# EAGLE design charger_and_dc_dc_ctrl (EAGLE 6.6.0)

## Sheet 1 of 3: Processor and Supply
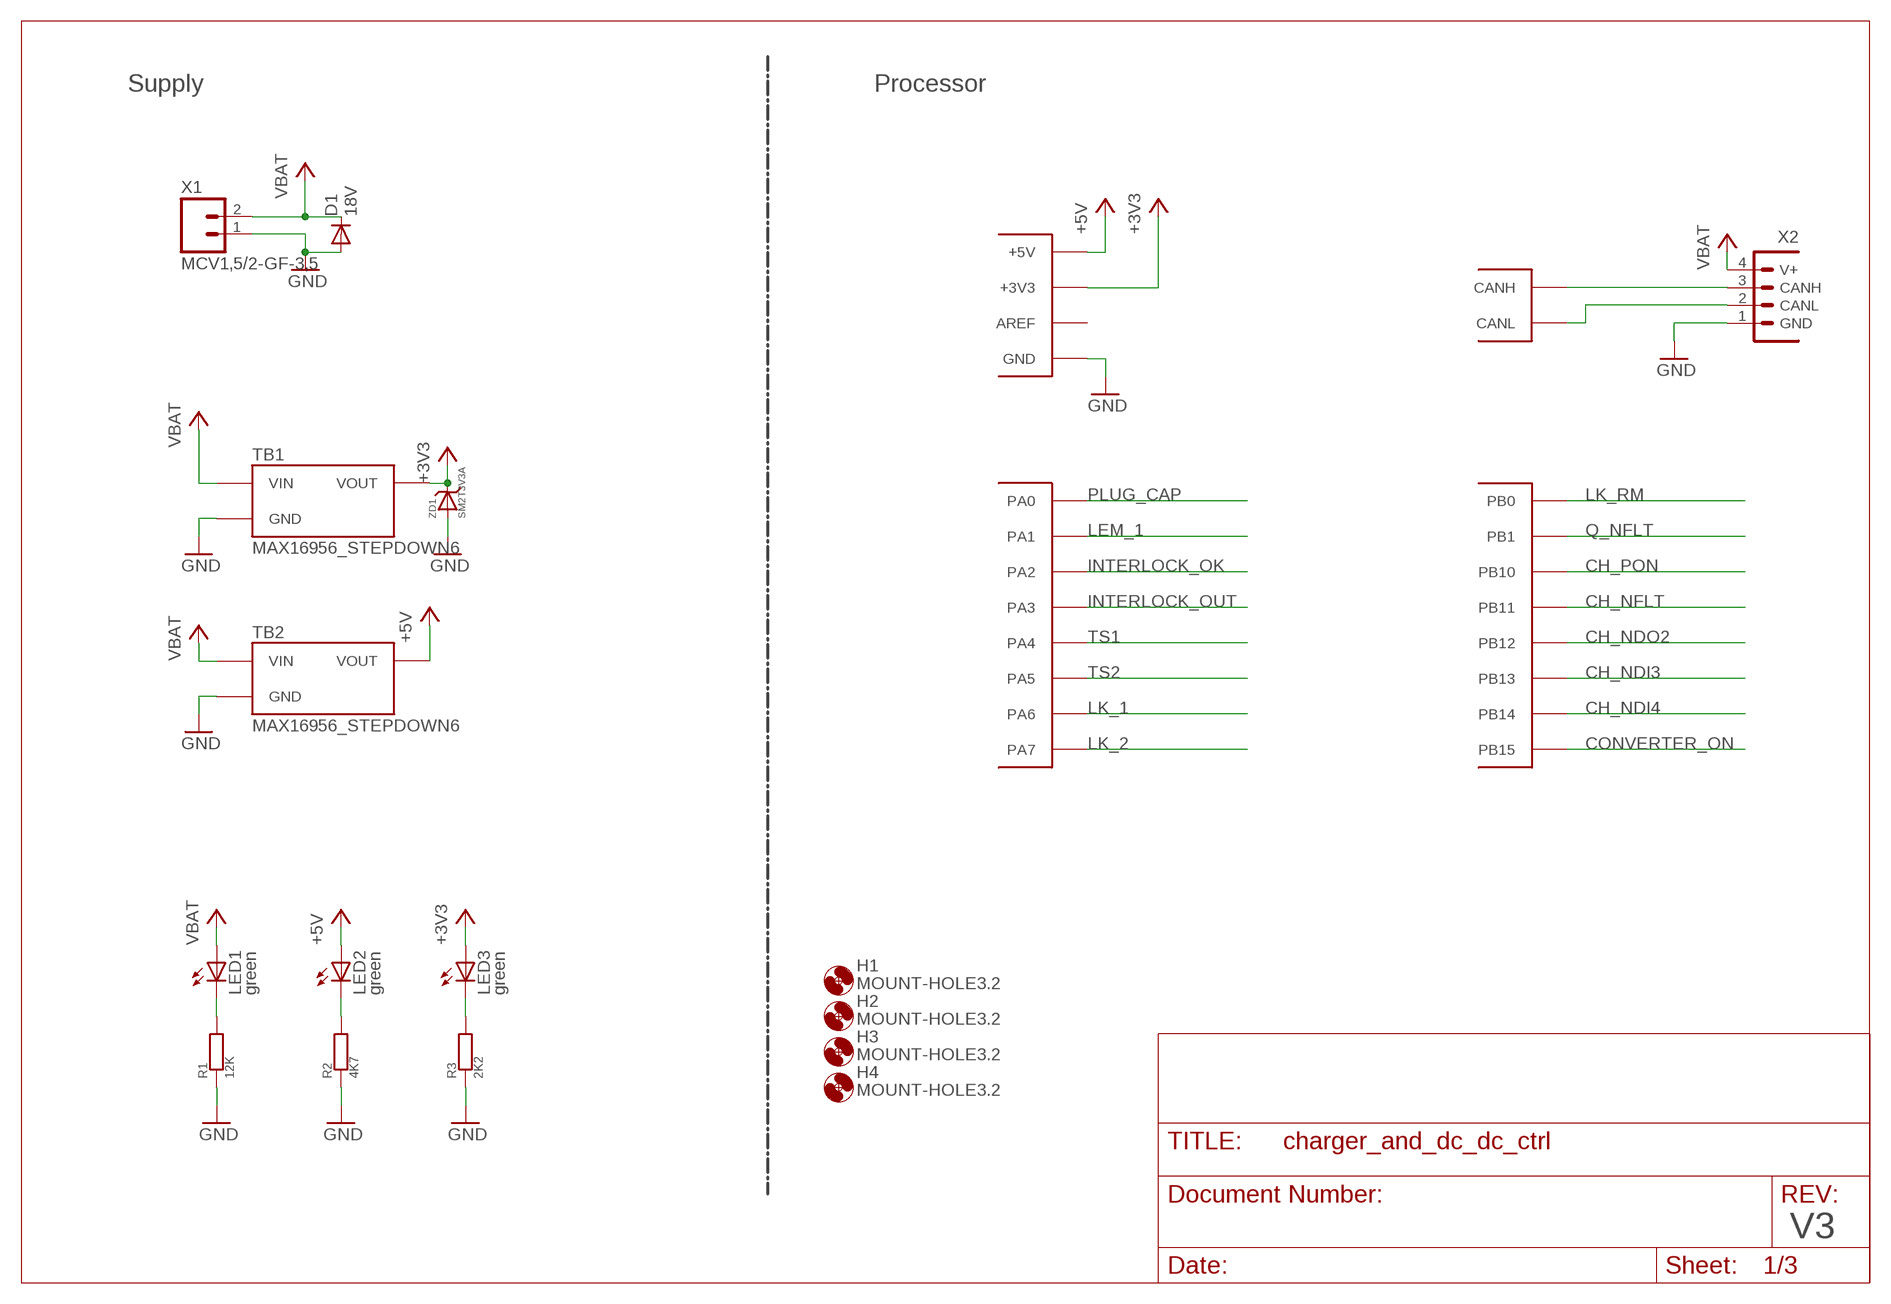
[diagram p0: schematic, sheet 1]

### Parts
CANIO_1  STM32F103XX_CAN-IO-EXPANDERC  [STM32F103XX_CANIO-EXPANDER3]
D1  18V  DIODE-DO214AA  [DO214AA]
H1  MOUNT-HOLE3.2  [3,2]
H2  MOUNT-HOLE3.2  [3,2]
H3  MOUNT-HOLE3.2  [3,2]
H4  MOUNT-HOLE3.2  [3,2]
LED1  green  LEDCHIP-LED0805  [CHIP-LED0805]
LED2  green  LEDCHIP-LED0805  [CHIP-LED0805]
LED3  green  LEDCHIP-LED0805  [CHIP-LED0805]
R1  12K  R  [R0805]
R2  4K7  R  [R0805]
R3  2K2  R  [R0805]
TB1  MAX16956_STEPDOWN6  [MAX16956_STEPDOWN6]
TB2  MAX16956_STEPDOWN6  [MAX16956_STEPDOWN6]
X1  MCV1,5/2-GF-3,5  [MCV1,5/2-GF-3,5]
X2  CIOC_4-1-FV-A_CAN-BELEGUNG  [CIOC_4-1-FV]
ZD1  SM2T3V3A  [SM2T3V3A]

### Nets
+3V3: CANIO_1.VCC(+3V3) LED3.A TB1.VOUT ZD1.P$2 ; also sheet 2,3
+5V: CANIO_1.+5V LED2.A TB2.VOUT ; also sheet 2
CAN1_H: CANIO_1.CANH X2.3(CANH)
CAN1_L: CANIO_1.CANL X2.2(CANL)
CH_NDI3: CANIO_1.PB13 ; also sheet 3
CH_NDI4: CANIO_1.PB14 ; also sheet 3
CH_NDO2: CANIO_1.PB12 ; also sheet 3
CH_NFLT: CANIO_1.PB11 ; also sheet 3
CH_PON: CANIO_1.PB10 ; also sheet 3
CONVERTER_ON: CANIO_1.PB15 ; also sheet 3
GND: CANIO_1.GND1(GND) D1.A R1.1 R2.1 R3.1 TB1.GND TB1.GND2(GND) TB2.GND TB2.GND2(GND) X1.1 X2.1(GND) ZD1.P$1 ZD1.P$11 ; also sheet 2,3
INTERLOCK_OK: CANIO_1.PA2 ; also sheet 2
INTERLOCK_OUT: CANIO_1.PA3 ; also sheet 2
LEM_1: CANIO_1.PA1 ; also sheet 2
LK_1: CANIO_1.PA6 ; also sheet 3
LK_2: CANIO_1.PA7 ; also sheet 3
LK_RM: CANIO_1.PB0 ; also sheet 3
N$1: LED2.C R2.2
N$2: LED3.C R3.2
N$5: LED1.C R1.2
PLUG_CAP: CANIO_1.PA0 ; also sheet 3
Q_NFLT: CANIO_1.PB1 ; also sheet 3
TS1: CANIO_1.PA4 ; also sheet 2
TS2: CANIO_1.PA5 ; also sheet 2
VBAT: D1.C LED1.A TB1.VIN TB2.VIN X1.2 X2.4(V+) ; also sheet 2,3
Unconnected: CANIO_1.AREF

### Notes on the sheet
- Supply | Processor
- V3

## Sheet 2 of 3: IO
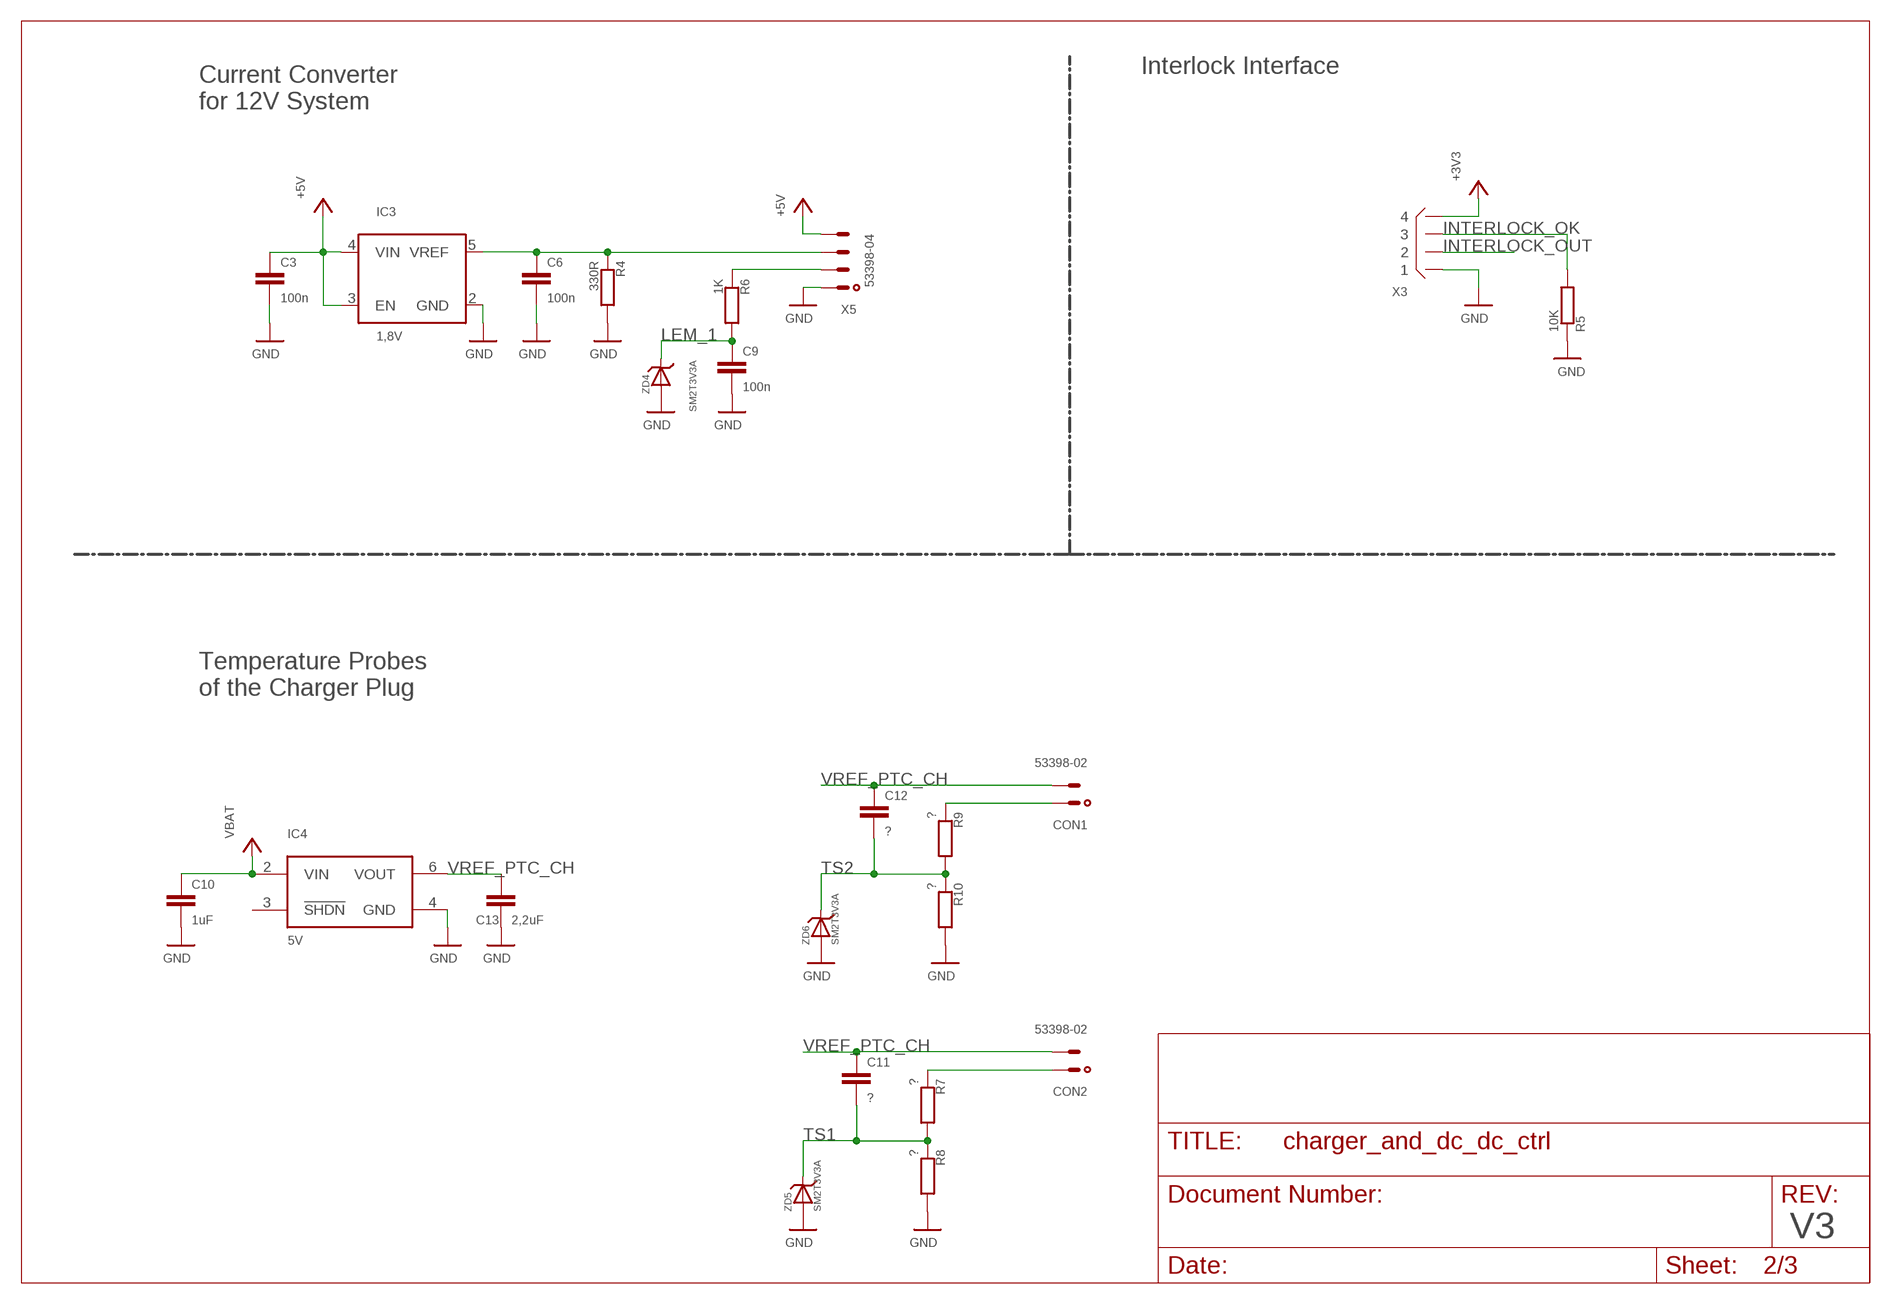
[diagram p1: schematic, sheet 2]

### Parts
C3  100n  C-EUC0805  [C0805]
C6  100n  C-EUC0805  [C0805]
C9  100n  C-EUC0805  [C0805]
C10  1uF  C-EUC0805  [C0805]
C11  ?  C-EUC0805  [C0805]
C12  ?  C-EUC0805  [C0805]
C13  2,2uF  C-EUC0805  [C0805]
CON1  53398-02  [53398-02]
CON2  53398-02  [53398-02]
IC3  1,8V  LM4132L  [SOT23-5L]
IC4  5V  LT1461  [SO08]
R4  330R  R  [R0805]
R5  10K  R0603  [R0603]
R6  1K  R  [R0805]
R7  ?  R  [R0805]
R8  ?  R  [R0805]
R9  ?  R  [R0805]
R10  ?  R  [R0805]
X3  B4B-XH  [B4B-XH]
X5  53398-04  [53398-04]
ZD4  SM2T3V3A  [SM2T3V3A]
ZD5  SM2T3V3A  [SM2T3V3A]
ZD6  SM2T3V3A  [SM2T3V3A]

### Nets
+3V3: X3.P$4 ; also sheet 1,3
+5V: C3.1 IC3.3(EN) IC3.4(VIN) X5.4 ; also sheet 1
GND: C3.2 C6.2 C9.2 C10.2 C13.2 IC3.2(GND) IC4.4(GND) R4.2 R5.1 R8.2 R10.2 X3.P$1 X5.1 ZD4.P$1 ZD4.P$11 ZD5.P$1 ZD5.P$11 ZD6.P$1 ZD6.P$11 ; also sheet 1,3
INTERLOCK_OK: R5.2 X3.P$3 ; also sheet 1
INTERLOCK_OUT: X3.P$2 ; also sheet 1
LEM_1: C9.1 R6.2 ZD4.P$2 ; also sheet 1
N$7: R6.1 X5.2
N$25: CON1.1 R9.1
N$32: C6.1 IC3.5(VREF) R4.1 X5.3
N$35: CON2.1 R7.1
TS1: C11.2 R7.2 R8.1 ZD5.P$2 ; also sheet 1
TS2: C12.2 R9.2 R10.1 ZD6.P$2 ; also sheet 1
VBAT: C10.1 IC4.2(VIN) ; also sheet 1,3
VREF_PTC_CH: C11.1 C12.1 C13.1 CON1.2 CON2.2 IC4.6(VOUT)
Unconnected: IC4.3(!SHDN)

### Notes on the sheet
- Interlock Interface
- Current Converter
  for 12V System
- Temperature Probes
  of the Charger Plug
- V3

## Sheet 3 of 3: Laderegler und Ladestecker
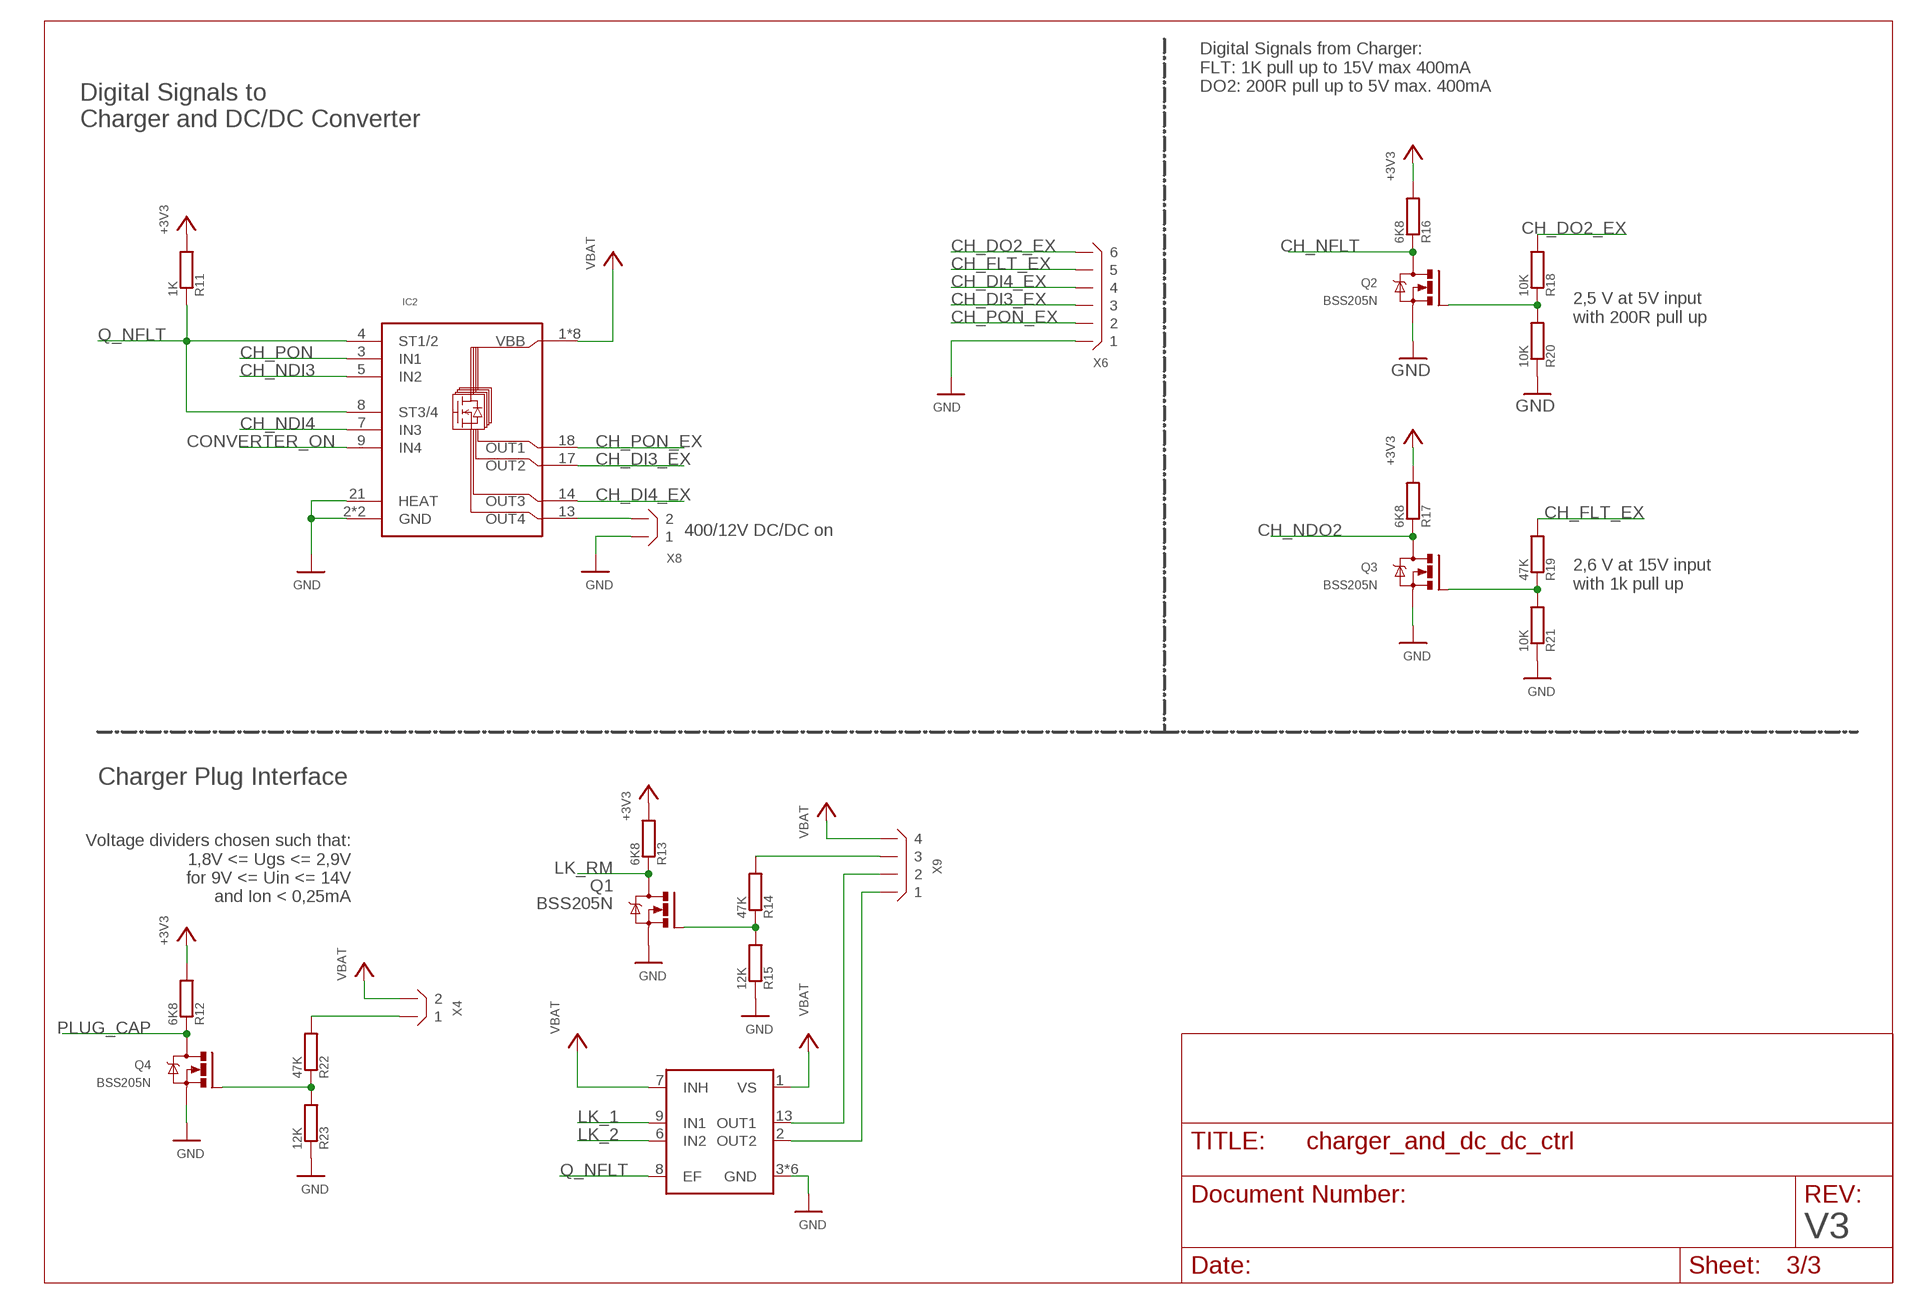
[diagram p2: schematic, sheet 3]

### Parts
IC2  BTS716G-NEWM  [INF-PG-DSO-20-30_M_1PRIMARY]
IC6  TLE4207GN  [INF-PG-DSO-14-22_N_1PRIMARY]
Q1  BSS205N  [SOT23]
Q2  BSS205N  [SOT23]
Q3  BSS205N  [SOT23]
Q4  BSS205N  [SOT23]
R11  1K  R0603  [R0603]
R12  6K8  R0603  [R0603]
R13  6K8  R  [R0805]
R14  47K  R  [R0805]
R15  12K  R  [R0805]
R16  6K8  R0603  [R0603]
R17  6K8  R0603  [R0603]
R18  10K  R0603  [R0603]
R19  47K  R0603  [R0603]
R20  10K  R0603  [R0603]
R21  10K  R0603  [R0603]
R22  47K  R0603  [R0603]
R23  12K  R0603  [R0603]
X4  B2B-XH  [B2B-XH]
X6  B6B-XH  [B6B-XH]
X8  B2B-XH  [B2B-XH]
X9  B4B-XH  [B4B-XH]

### Nets
+3V3: R11.2 R12.2 R13.2 R16.2 R17.2 ; also sheet 1,2
CH_DI3_EX: IC2.17(OUT2) X6.P$3
CH_DI4_EX: IC2.14(OUT3) X6.P$4
CH_DO2_EX: R18.2 X6.P$6
CH_FLT_EX: R19.2 X6.P$5
CH_NDI3: IC2.5(IN2) ; also sheet 1
CH_NDI4: IC2.7(IN3) ; also sheet 1
CH_NDO2: Q3.3(D) R17.1 ; also sheet 1
CH_NFLT: Q2.3(D) R16.1 ; also sheet 1
CH_PON: IC2.3(IN1) ; also sheet 1
CH_PON_EX: IC2.18(OUT1) X6.P$2
CONVERTER_ON: IC2.9(IN4) ; also sheet 1
GND: IC2.2(GND) IC2.6(GND) IC2.21(HEAT) IC6.3(GND) IC6.4(GND) IC6.5(GND) IC6.10(GND) IC6.11(GND) IC6.12(GND) Q1.2(S) Q2.2(S) Q3.2(S) Q4.2(S) R15.1 R20.1 R21.1 R23.1 X6.P$1 X8.P$1 ; also sheet 1,2
LK_1: IC6.9(IN1) ; also sheet 1
LK_2: IC6.6(IN2) ; also sheet 1
LK_RM: Q1.3(D) R13.1 ; also sheet 1
N$3: IC2.13(OUT4) X8.P$2
N$4: Q4.1(G) R22.1 R23.2
N$6: R22.2 X4.P$1
N$16: Q3.1(G) R19.1 R21.2
N$38: Q1.1(G) R14.1 R15.2
N$39: R14.2 X9.P$3
N$41: IC6.13(OUT1) X9.P$2
N$42: IC6.2(OUT2) X9.P$1
N$45: Q2.1(G) R18.1 R20.2
PLUG_CAP: Q4.3(D) R12.1 ; also sheet 1
Q_NFLT: IC2.4(ST1/2) IC2.8(ST3/4) IC6.8(EF) R11.1 ; also sheet 1
VBAT: IC2.1(VBB) IC2.10(VBB) IC2.11(VBB) IC2.12(VBB) IC2.15(VBB) IC2.16(VBB) IC2.19(VBB) IC2.20(VBB) IC6.1(VS) IC6.7(INH) X4.P$2 X9.P$4 ; also sheet 1,2

### Notes on the sheet
- Digital Signals from Charger:
  FLT: 1K pull up to 15V max 400mA
  DO2: 200R pull up to 5V max. 400mA
- Digital Signals to
  Charger and DC/DC Converter
- 2,5 V at 5V input 
  with 200R pull up
- 400/12V DC/DC on
- 2,6 V at 15V input
  with 1k pull up
- Charger Plug Interface
- Voltage dividers chosen such that:
  1,8V <= Ugs <= 2,9V
  for 9V <= Uin <= 14V
  and Ion < 0,25mA
- V3

## Library data of the parts
C3 C6 C9-C13 = rcl:C-EU: CAPACITOR, European symbol
CANIO_1 = tera-boards:STM32F103XX_CAN-IO-EXPANDER: Tera CAN-IO Expander Board
CON1 CON2 = con-molex:53?-02: CONNECTOR wire to board 1.25 mm (.049 inch) pitch header
D1 = diode:DIODE-: DIODE
H1-H4 = holes:MOUNT-HOLE: MOUNTING HOLE with drill center marker
IC2 = infineon:BTS716G-NEW
IC3 = ti:LM4132
IC4 = linear:LT1461
IC6 = infineon:TLE4207G
LED1-LED3 = led:LED: LED OSRAM: - CHIPLED LG R971, LG N971, LY N971, LG Q971, LY Q971, LO R971, LY R971 LH N974, LH R974 LS Q976, LO Q976, LY Q976 LO Q996 - Hyper CHIPLED LW Q18S LB Q993, LB Q99A, LB R99A - SideLED LS A670, LO A670, LY A670, LG A670, LP A670 LB A673, LV A673, LT A673, LW A673 LH A674 LY A675 LS A676, LA A676, LO A676, LY A676, LW A676 LS A679, LY A679, LG A679 - Hyper Micro SIDELED® LS Y876, LA Y876, LO Y876, LY Y876 LT Y87S - SmartLED LW L88C, LW L88S LB L89C, LB L89S, LG L890 LS L89K, LO L89K, LY L89K LS L896, LA L896, LO L896, LY L896 - TOPLED LS T670, LO T670, LY T670, LG T670, LP T670 LSG T670, LSP T670, LSY T670, LOP T670, LYG T670 LG T671, LOG T671, LSG T671 LB T673, LV T673, LT T673, LW T673 LH T674 LS T676, LA T676, LO T676, LY T676, LB T676, LH T676, LSB T676, LW T676 LB T67C, LV T67C, LT T67C, LS T67K, LO T67K, LY T67K, LW E67C LS E67B, LA E67B, LO E67B, LY E67B, LB E67C, LV E67C, LT E67C LW T67C LS T679, LY T679, LG T679 LS T770, LO T770, LY T770, LG T770, LP T770 LB T773, LV T773, LT T773, LW T773 LH T774 LS E675, LA E675, LY E675, LS T675 LS T776, LA T776, LO T776, LY T776, LB T776 LHGB T686 LT T68C, LB T68C - Hyper Mini TOPLED® LB M676 - Mini TOPLED Santana® LG M470 LS M47K, LO M47K, LY M47K Source: http://www.osram.convergy.de LUXEON: - LUMILED® LXK2-PW12-R00, LXK2-PW12-S00, LXK2-PW14-U00, LXK2-PW14-V00 LXK2-PM12-R00, LXK2-PM12-S00, LXK2-PM14-U00 LXK2-PE12-Q00, LXK2-PE12-R00, LXK2-PE12-S00, LXK2-PE14-T00, LXK2-PE14-U00 LXK2-PB12-K00, LXK2-PB12-L00, LXK2-PB12-M00, LXK2-PB14-N00, LXK2-PB14-P00, LXK2-PB14-Q00 LXK2-PR12-L00, LXK2-PR12-M00, LXK2-PR14-Q00, LXK2-PR14-R00 LXK2-PD12-Q00, LXK2-PD12-R00, LXK2-PD12-S00 LXK2-PH12-R00, LXK2-PH12-S00 LXK2-PL12-P00, LXK2-PL12-Q00, LXK2-PL12-R00 Source: www.luxeon.com KINGBRIGHT: KA-3528ASYC Source: www.kingbright.com
Q1-Q4 = infineon:BSS205N: Infineon Small Signal Transistor, OptiMOS 2 Technology, 20V, 2.5A SOT23
R1-R23 = useful:R
TB1 TB2 = tera-boards:MAX16956_STEPDOWN6
X1 = con-phoenix:MCV1,5/2-GF-3,5
X2 = con-phoenix:CIOC_4-1-FV-A_CAN-BELEGUNG: CIOC_4-1-FV-A mit Bezeichnungen für CAN-Signale und Versorgungen; MANUF: Phoenix-Contact; ORDERNR: 1701388
X3 X9 = con-jst-xh:?4B-XH
X4 X8 = con-jst-xh:?2B-XH
X5 = con-molex:53?-04: CONNECTOR wire to board 1.25 mm (.049 inch) pitch header
X6 = con-jst-xh:?6B-XH
ZD1 ZD4-ZD6 = st:SM2T3V3A: ST2T3V3A Low voltage TransilTM

## Board
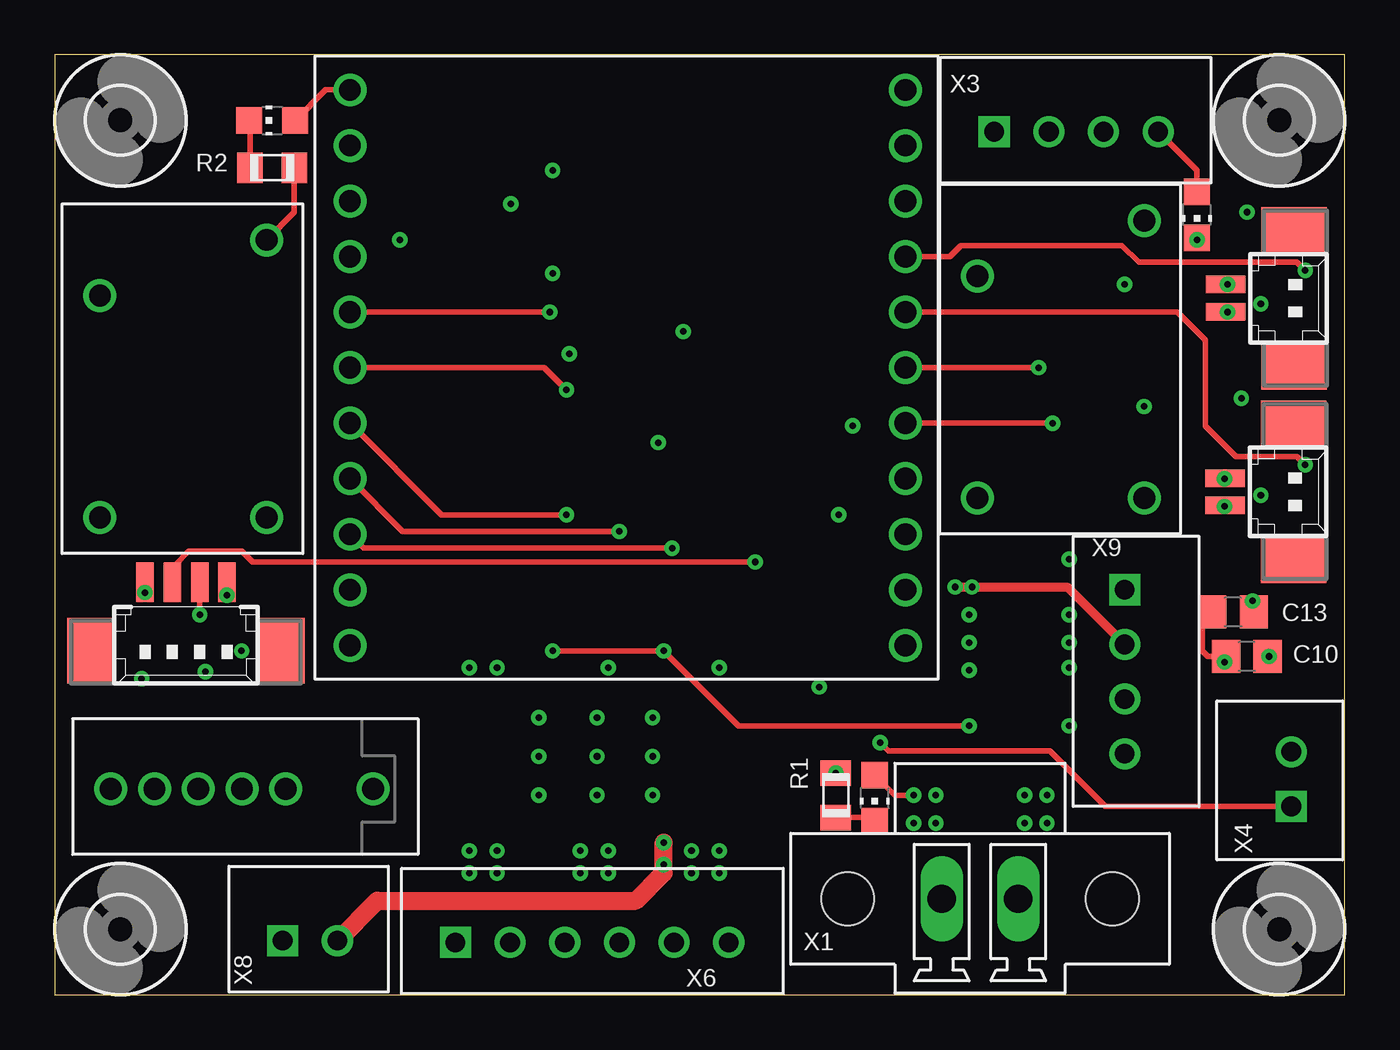
[diagram p3: board, top side]
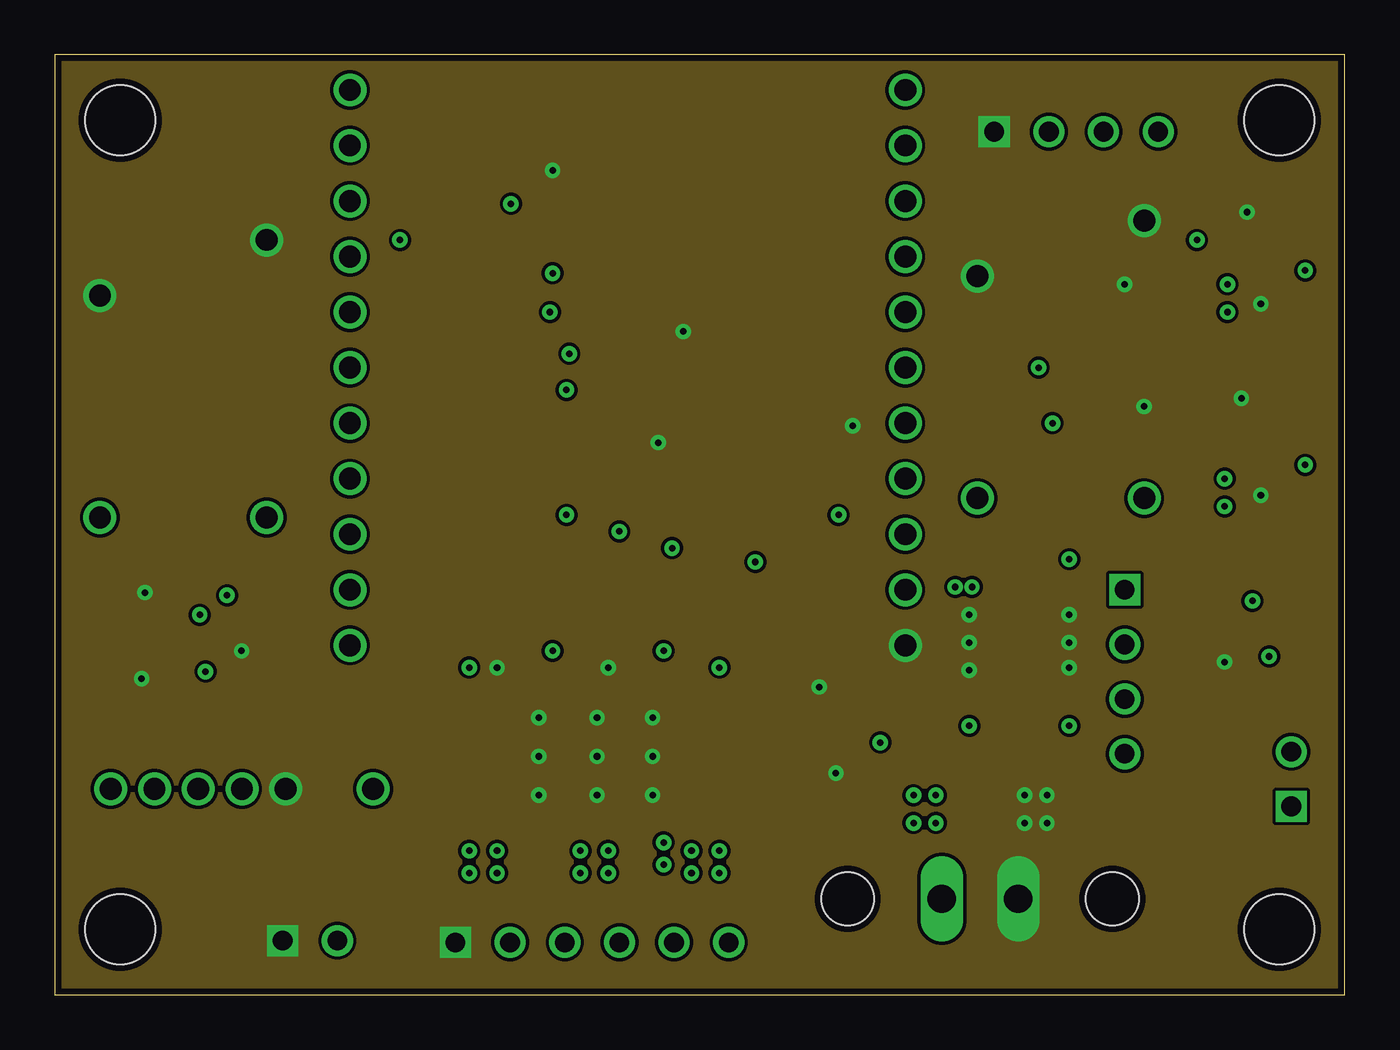
[diagram p4: board, inner layer Route2]
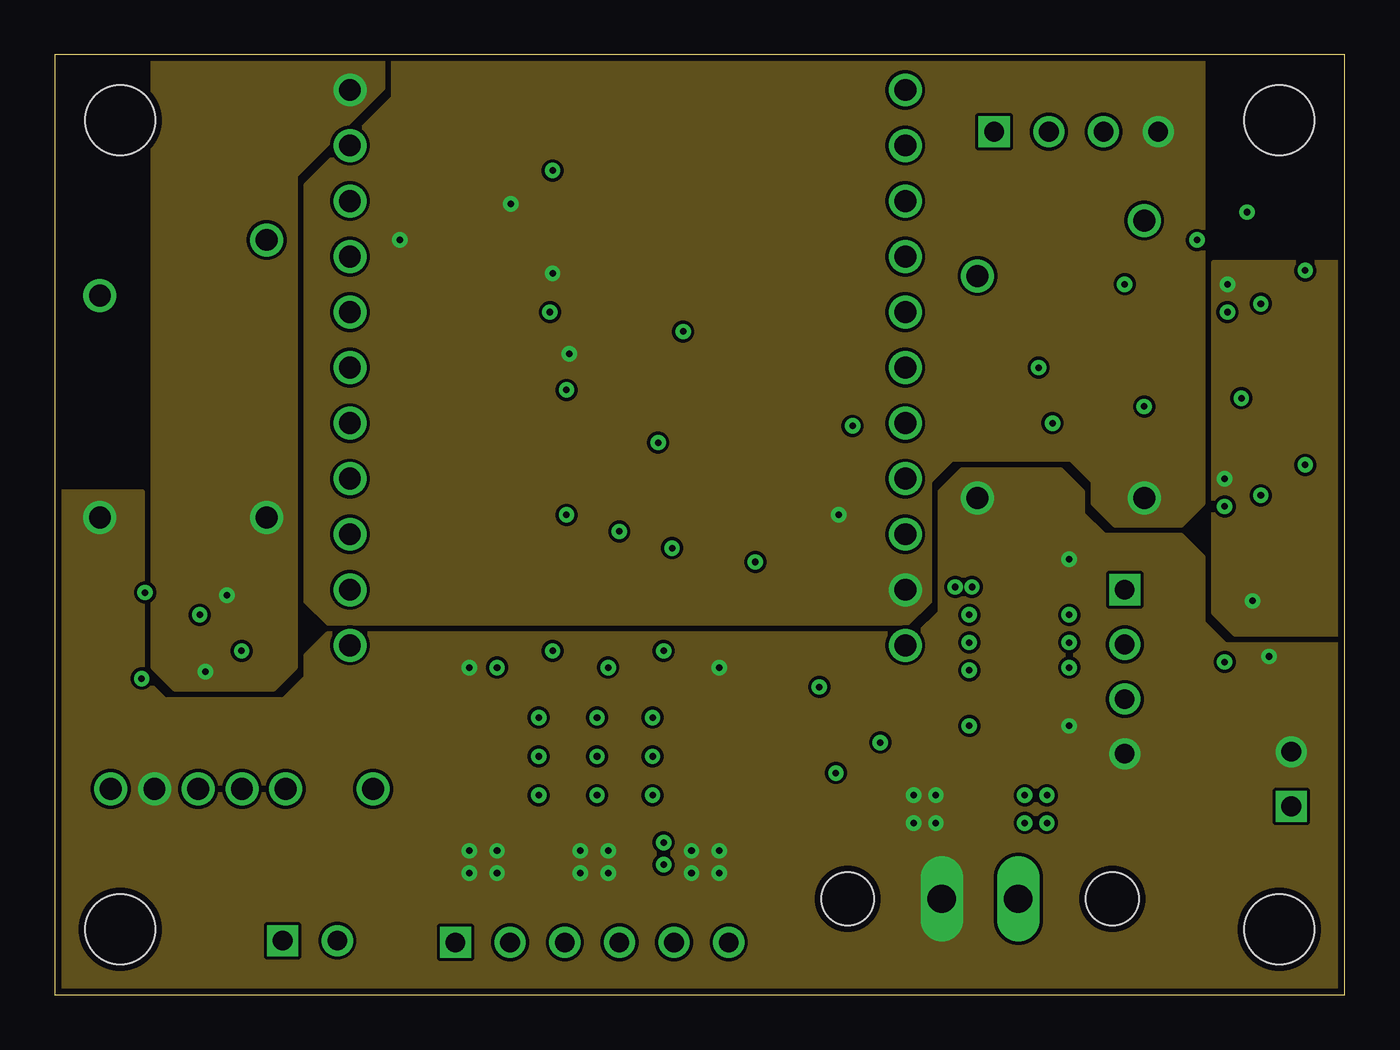
[diagram p5: board, inner layer Route15]
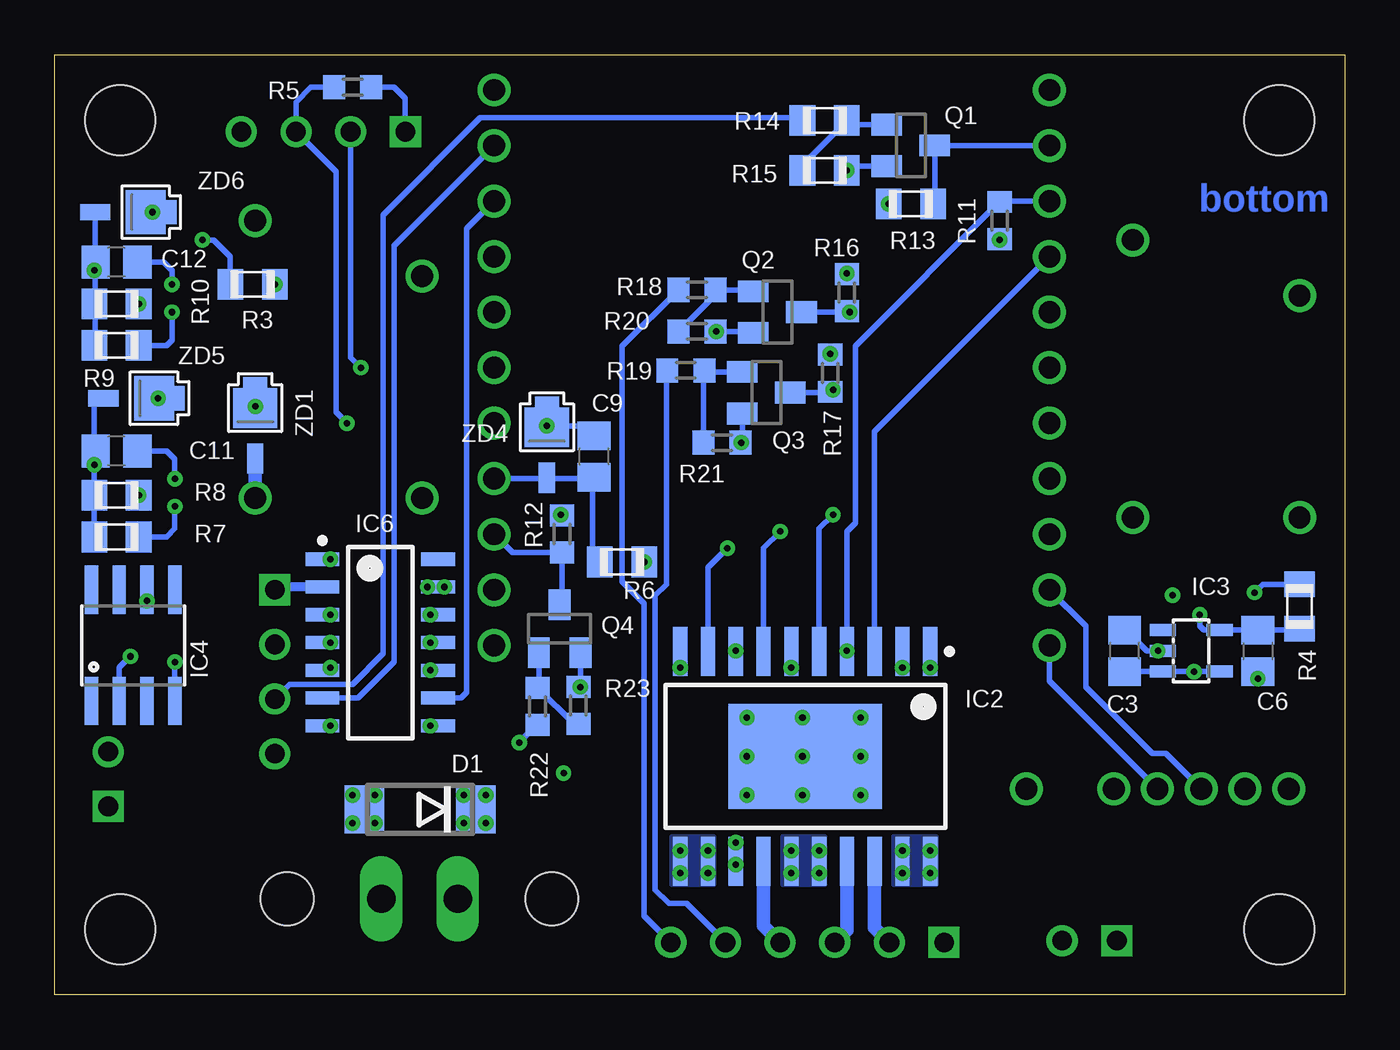
[diagram p6: board, bottom side, seen from below]

Size 59 x 43 mm. Coordinates in mm from the lower left corner, seen from the top.
Outline: 0,0 59,0 59,43 0,43 0,0
Copper layers (1+2*15+16): Top 0.035mm / dielectric 0.2mm / Route2 0.035mm / dielectric 0.5mm / Route15 0.035mm / dielectric 0.2mm / Bottom 0.035mm
Design rules "ats_35u_4layer *": minimum track width 6mil, minimum drill 0.2mm, track to track 6mil, track to pad 6mil, pad to pad 6mil, via to via 6mil, smd to smd 6mil, copper to edge 0.3mm, drill to drill 8mil, minimum pad ring 10mil, minimum via ring 0.2mm, stop-mask expansion 4mil, vias tented up to drill 0mil, thermal gap 10mil

### Footprints (pad centres in the part's own frame; a part is rotated, then mirrored left to right if it is on the bottom)
C0805 = smd 1.3 x 1.5: 1 -0.95,0; 2 0.95,0
STM32F103XX_CANIO-EXPANDER3 = drill 1: +5V -12.7,12.7; AREF 12.7,12.7; CANH -12.7,-10.16; CANL -12.7,-12.7; GND1 12.7,-12.7; PA0 12.7,-7.62; PA1 12.7,-5.08; PA2 12.7,-2.54; PA3 12.7,0; PA4 12.7,2.54; PA5 12.7,5.08; PA6 12.7,7.62; PA7 12.7,10.16; PB0 -12.7,10.16; PB1 -12.7,7.62; PB10 -12.7,5.08; PB11 -12.7,2.54; PB12 -12.7,0; PB13 -12.7,-2.54; PB14 -12.7,-5.08; PB15 -12.7,-7.62; VCC 12.7,-10.16
53398-02 = smd 0.8 x 1.8: 1 0.625,-2.5; 2 -0.625,-2.5 | smd 2.1 x 3: S1 3.125,0.625; S2 -3.125,0.625
DO214AA = smd 1.8 x 2.2: A 2.55,0; C -2.55,0
3,2 = hole 3.2: 0,0
INF-PG-DSO-20-30_M_1PRIMARY = smd 2.25 x 0.65: 1 -4.8,5.715; 2 -4.8,4.445; 3 -4.8,3.175; 4 -4.8,1.905; 5 -4.8,0.635; 6 -4.8,-0.635; 7 -4.8,-1.905; 8 -4.8,-3.175; 9 -4.8,-4.445; 10 -4.8,-5.715; 11 4.8,-5.715; 12 4.8,-4.445; 13 4.8,-3.175; 14 4.8,-1.905; 15 4.8,-0.635; 16 4.8,0.635; 17 4.8,1.905; 18 4.8,3.175; 19 4.8,4.445; 20 4.8,5.715 | smd 4.8 x 7: 21 0,0
SOT23-5L = smd 0.55 x 1.2: 1 -0.95,-1.3; 2 0,-1.3; 3 0.95,-1.3; 4 0.95,1.3; 5 -0.95,1.3
SO08 = smd 0.61 x 2.21: 1 -1.905,-2.54; 2 -0.635,-2.54; 3 0.635,-2.54; 4 1.905,-2.54; 5 1.905,2.54; 6 0.635,2.54; 7 -0.635,2.54; 8 -1.905,2.54
INF-PG-DSO-14-22_N_1PRIMARY = smd 1.55 x 0.6: 1 -2.65,3.81; 2 -2.65,2.54; 3 -2.65,1.27; 4 -2.65,0; 5 -2.65,-1.27; 6 -2.65,-2.54; 7 -2.65,-3.81; 8 2.65,-3.81; 9 2.65,-2.54; 10 2.65,-1.27; 11 2.65,0; 12 2.65,1.27; 13 2.65,2.54; 14 2.65,3.81
CHIP-LED0805 = smd 1.2 x 1.2: A 0,-1.05; C 0,1.05
SOT23 = smd 1 x 1.4: 1 -0.95,-1.1; 2 0.95,-1.1; 3 0,1.1
R0805 = smd 1.168 x 1.397: 1 -1.016,0; 2 1.016,0
R0603 = smd 1 x 1.1: 1 -0.85,0; 2 0.85,0
MAX16956_STEPDOWN6 = drill 1: GND 14.351,1.651; GND2 11.811,9.271; VIN 1.651,9.271; VOUT 1.651,1.651
MCV1,5/2-GF-3,5 = drill 1.3 long: 1 0,3.5; 2 0,0 | hole 2.4: 0,7.8; 0,-4.3
CIOC_4-1-FV = drill 1: 1 0,0; 2 2,0; 3 4,0; 4 6,0; 5 -4,0; 6 8,0
B4B-XH = drill 0.9 pad 1.422 square: P$1 0,0 | drill 0.9 pad 1.422: P$2 2.5,0; P$3 5,0; P$4 7.5,0
B2B-XH = drill 0.9 pad 1.422 square: P$1 0,0 | drill 0.9 pad 1.422: P$2 2.5,0
53398-04 = smd 0.8 x 1.8: 1 1.875,-2.5; 2 0.625,-2.5; 3 -0.625,-2.5; 4 -1.875,-2.5 | smd 2.1 x 3: S1 4.375,0.625; S2 -4.375,0.625
B6B-XH = drill 0.9 pad 1.422 square: P$1 0,0 | drill 0.9 pad 1.422: P$2 2.5,0; P$3 5,0; P$4 7.5,0; P$5 10,0; P$6 12.5,0
SM2T3V3A = smd 1.82 x 2.03: P$1 -1.21,0 | smd 1.38 x 0.75: P$2 1.1,0 | smd 0.5 x 1.1: P$11 -2.37,0.005

### Placement (x,y rotation side)
C3  10.07,15.73 90 bottom
C6  3.98,15.73 270 bottom
C9  34.33,24.62 90 bottom
C10  54.52,15.48 180 top
C11  56.17,24.88 180 bottom
C12  56.17,33.51 180 bottom
C13  53.89,17.51 180 top
CANIO_1  26.2,28.69 0 top
CON1  56.05,31.86 270 top
CON2  56.03,23.01 270 top
D1  42.29,8.48 180 bottom
H1  3,3 0 top
H2  3,40 0 top
H3  56,3 0 top
H4  56,40 0 top
IC2  24.68,10.91 270 bottom
IC3  7.02,15.73 270 bottom
IC4  55.41,15.99 0 bottom
IC6  44.11,16.11 0 bottom
LED1  37.5,9 180 top
LED2  9.95,39.99 90 top
LED3  52.24,35.67 180 top
Q1  19.85,38.85 270 bottom
Q2  25.95,31.23 270 bottom
Q3  26.45,27.54 270 bottom
Q4  35.91,16.75 0 bottom
R1  35.73,9.13 270 top
R2  9.95,37.83 180 top
R3  49.95,32.5 180 bottom
R4  2.07,17.76 90 bottom
R5  45.38,41.51 180 bottom
R6  33.06,19.8 180 bottom
R7  56.17,20.94 180 bottom
R8  56.17,22.84 0 bottom
R9  56.17,29.7 180 bottom
R10  56.17,31.61 0 bottom
R11  15.79,35.42 270 bottom
R12  35.8,21.07 90 bottom
R13  19.85,36.18 180 bottom
R14  23.79,39.99 180 bottom
R15  23.79,37.7 180 bottom
R16  22.77,32.11 90 bottom
R17  23.53,28.43 90 bottom
R18  29.63,32.24 180 bottom
R19  30.14,28.56 180 bottom
R20  29.63,30.34 180 bottom
R21  28.49,25.26 180 bottom
R22  36.92,13.19 270 bottom
R23  35.05,13.23 270 bottom
TB1  51.47,21.07 90 top
TB2  11.34,20.18 90 top
X1  40.57,4.39 270 top
X2  10.57,9.42 180 top
X3  42.97,39.48 0 top
X4  56.55,8.62 90 top
X5  6.01,16.37 180 top
X6  18.33,2.4 0 top
X8  10.43,2.48 0 top
X9  48.93,18.53 270 top
ZD1  49.83,25.63 270 bottom
ZD4  36.49,24.75 270 bottom
ZD5  55.66,27.29 180 bottom
ZD6  56.05,35.8 180 bottom

### Tracks (layer width: path | path; a pad name or v marks a point on that pad's centre or on a via)
+3V3  (via drill 0.3)
  Top 0.254: LED3.A 52.24,37.71 X3.P$4
  Bottom 0.254: R11.2 v15.79,34.53 | R17.2 v23.53,29.32 | R16.2 v22.77,33 | R12.2 35.82,21.92 v35.85,21.95
  Bottom 0.61: ZD1.P$2 TB1.VOUT
  other vias: 20.87,36.18
  pour Route15 (no thermals): 52.5,43 52.5,22.5 51.5,21.5 48.5,21.5 47.5,22.5 47.5,23.5 46.5,24.5 41,24.5 40,23.5 40,18 39,17 12.5,17 11.5,18 11.5,37 15.5,41 15.5,43
+5V  (via drill 0.3)
  Top 0.254: X5.4 v7.88,18.27 | LED2.A 12.39,41.39 CANIO_1.+5V
  Bottom 0.254: C3.1 IC3.3 v6.9,14.78 IC3.4
  pour Route15 (no thermals): 15,43 15,41.5 11,37.5 11,15 10,14 5.5,14 4.5,15 4.5,43
CAN1_H
  Bottom 0.254: CANIO_1.CANH 11.85,16.88 11.85,14.08 8.8,11.03 8.18,11.03 X2.3
CAN1_L
  Bottom 0.254: CANIO_1.CANL 13.5,14.36 X2.2
CH_DI3_EX
  Bottom 0.61: IC2.17 22.77,2.95 X6.P$3
CH_DI4_EX
  Bottom 0.61: IC2.14 26.58,3.15 X6.P$4
CH_DO2_EX
  Bottom 0.254: X6.P$6 32.04,3.61 32.04,17.89 33.06,18.91 33.06,29.66 R18.2
CH_FLT_EX
  Bottom 0.254: X6.P$5 30.11,4.17 30.9,4.17 31.54,4.81 31.54,18.27 31.03,18.78 31.03,28.52 R19.2
CH_NDI3  (via drill 0.3)
  Top 0.254: CANIO_1.PB13 17.69,21.95 v23.41,21.95
  Bottom 0.254: IC2.5 24.04,21.32 v23.41,21.95
CH_NDI4  (via drill 0.3)
  Top 0.254: CANIO_1.PB14 15.91,21.19 v25.82,21.19
  Bottom 0.254: IC2.7 26.58,20.43 v25.82,21.19
CH_NDO2  (via drill 0.3)
  Top 0.254: CANIO_1.PB12 22.39,28.69 v23.41,27.67
  Bottom 0.254: Q3.3 23.57,27.54 R17.1 23.5,27.58 v23.41,27.67
CH_NFLT  (via drill 0.3)
  Top 0.254: CANIO_1.PB11 v22.64,31.23
  Bottom 0.254: Q2.3 22.81,31.23 R16.1 22.73,31.23 v22.64,31.23
CH_PON
  Bottom 0.254: CANIO_1.PB10 21.5,25.77 IC2.3
CH_PON_EX
  Bottom 0.61: IC2.18 21.5,3.07 X6.P$2
CONVERTER_ON  (via drill 0.3)
  Top 0.254: CANIO_1.PB15 14.14,20.43 v28.23,20.43
  Bottom 0.254: v28.23,20.43 29.12,19.54 IC2.9
GND  (via drill 0.3)
  Top 0.254: X5.1 v4.13,18.4 | C13.2 52.49,17.51 52.49,15.73 52.74,15.48 C10.2 53.51,15.41 v53.51,15.22 | R2.1 10.96,35.8 TB2.GND
  Bottom 0.254: C6.2 v3.98,14.46 | C3.2 10.01,16.68 9.06,15.73 v8.55,15.73 | IC3.2 v8.55,15.73 | 8.93,15.73 v8.55,15.73 | D1.A 44.84,8.34 v44.36,7.86 | IC6.12 v41.82,17.38 | v41.82,16.11 IC6.11 | v41.82,14.84 IC6.10 | v46.39,17.38 IC6.3 | Q1.2 22.71,37.9 R15.1 22.9,37.83 | IC6.5 v46.39,14.97 | IC6.4 v46.39,16.11 | v24.8,10.91 IC2.21 | R4.2 3.75,18.78 v4.13,18.4 | IC2.2 v20.23,14.97 | IC2.6 v25.31,14.97 | R5.1 43.47,41.51 42.97,41.01 X3.P$1 | ZD6.P$11 v54.52,35.79 v54.52,35.8 ZD6.P$1 | ZD5.P$11 v54.26,27.28 v54.27,27.29 ZD5.P$1 | IC4.4 v53.51,15.22 | Q2.2 27.11,30.34 v28.74,30.34 R20.1 | v27.6,25.26 R21.1 27.55,25.34 Q3.2 | ZD4.P$11 v36.48,26.02 | v36.48,26.02 v36.49,26.02 ZD4.P$1 | v36.48,26.02 34.78,26.02 C9.2 | v34.96,14.08 34.93,14.08 R23.1 34.96,14.12 Q4.2 | ZD1.P$1 v49.83,26.9 v49.82,26.91 v49.83,26.91 ZD1.P$11
  other vias: 45.38,7.86 45.38,9.13 44.36,9.13 22.77,37.7 27.34,12.68 27.34,9.13 27.34,10.91 22.14,12.68 22.14,10.91 22.14,9.13 24.8,9.13 24.8,12.68 35.73,10.14 55.16,31.61 55.16,22.84 48.93,32.5
  pour Route2 (no thermals): 0,0 0,43 59,43 59,0
INTERLOCK_OK  (via drill 0.3)
  Top 0.254: v45.63,26.15 CANIO_1.PA2
  Bottom 0.254: R5.2 47.28,41.51 47.97,40.83 X3.P$3 46.14,37.66 46.14,26.65 v45.63,26.15
INTERLOCK_OUT  (via drill 0.3)
  Top 0.254: v45,28.69 CANIO_1.PA3
  Bottom 0.254: X3.P$2 45.47,29.15 v45,28.69
LEM_1
  Bottom 0.254: CANIO_1.PA1 36.49,23.61 | 36.49,23.61 34.39,23.61 | 34.39,23.61 C9.1 | ZD4.P$2 36.49,23.61 | 34.39,23.61 34.39,20.12 R6.2
LK_1
  Bottom 0.254: IC6.9 40.42,13.57 40.17,13.83 40.17,35.04 CANIO_1.PA6
LK_2
  Bottom 0.254: IC6.6 45.12,13.57 43.47,15.22 43.47,34.27 CANIO_1.PA7
LK_RM
  Bottom 0.254: CANIO_1.PB0 Q1.3 18.75,36.18 R13.1
N$1
  Top 0.254: R2.2 8.93,39.95 LED2.C
N$2  (via drill 0.3)
  Top 0.254: LED3.C v52.24,34.53
  Bottom 0.254: R3.2 50.97,33.77 51.73,34.53 v52.24,34.53
N$3  (via drill 0.3)
  Top 0.813: X8.P$2 14.75,4.3 26.58,4.3 27.85,5.57 v27.85,6.97
  Bottom 0.254: v27.85,6.97 IC2.13 v27.85,5.95
N$4
  Bottom 0.254: Q4.1 36.86,14.1 R22.1 35.26,12.38 R23.2
N$5
  Top 0.254: LED1.C 37.47,8.11 R1.2
N$6  (via drill 0.3)
  Top 0.254: X4.P$1 48.05,8.62 45.51,11.16 38.14,11.16 v37.76,11.54
  Bottom 0.254: v37.76,11.54 36.96,12.34 R22.2
N$7  (via drill 0.3)
  Top 0.254: X5.2 5.5,18.98 5.5,19.67 6.13,20.3 8.55,20.3 9.06,19.8 R6.1
  other vias: 32.04,19.8
N$16
  Bottom 0.254: Q3.1 29.22,28.49 R19.1 | 29.29,28.35 R19.1 | R21.2 29.34,28.51 R19.1
N$25  (via drill 0.3)
  Top 0.254: CON1.1 v53.62,31.24 v53.63,31.23
  Bottom 0.254: R9.1 53.89,29.7 53.63,29.96 v53.63,31.23
N$32  (via drill 0.3)
  Top 0.254: v6.63,17.38 X5.3
  Bottom 0.254: v6.63,17.38 6.63,16.87 6.45,16.68 IC3.5 C6.1 2.14,16.68 R4.1
N$35  (via drill 0.3)
  Top 0.254: CON2.1 53.53,22.36 v53.51,22.34
  Bottom 0.254: R7.1 53.89,20.94 53.51,21.32 v53.51,22.34
N$38
  Bottom 0.254: Q1.1 22.71,39.8 R14.1 24.8,37.96 R15.2
N$39
  Bottom 0.254: R14.2 24.93,40.12 39.54,40.12 43.98,35.67 43.98,15.61 45.38,14.21 48.25,14.21 X9.P$3
N$41  (via drill 0.3)
  Top 0.406: v41.19,18.65 v41.95,18.65 46.31,18.65 X9.P$2
  Bottom 0.254: IC6.13 v41.19,18.65
N$42
  Bottom 0.406: IC6.2 48.81,18.65 X9.P$1
N$45
  Bottom 0.254: R20.2 28.78,32.04 R18.1 27.11,32.24 Q2.1
PLUG_CAP
  Bottom 0.254: CANIO_1.PA0 38.06,20.22 R12.1 35.8,17.96 Q4.3
Q_NFLT  (via drill 0.3)
  Top 0.254: v41.82,12.3 31.28,12.3 v27.85,15.73 v22.77,15.73
  Bottom 0.254: CANIO_1.PB1 15.79,36.31 R11.1 22.39,29.66 22.39,21.57 22.77,21.19 v22.77,15.73 IC2.4 | IC6.8 v41.82,12.3 | v27.85,15.73 IC2.8
TS1  (via drill 0.3)
  Top 0.254: CANIO_1.PA4 51.35,31.23 52.62,29.96 52.62,26.02 54.01,24.62 56.81,24.62 v57.19,24.24
  Bottom 0.254: ZD5.P$2 57.19,27.29 57.19,24.5 | 57.19,24.5 R8.1 R7.2 | 57.19,24.5 57.12,24.56 C11.2 57.25,24.62 v57.19,24.24
TS2  (via drill 0.3)
  Top 0.254: CANIO_1.PA5 40.93,33.77 41.44,34.27 48.81,34.27 49.57,33.51 56.81,33.51 v57.19,33.13
  Bottom 0.254: C12.2 v57.19,33.13 57.15,33.13 | ZD6.P$2 57.15,33.13 | 57.15,33.13 57.15,31.86 | 57.15,31.86 57.15,30.25 R9.2 | R10.1 57.15,31.86
VBAT  (via drill 0.3)
  Top 0.254: C10.1 v55.54,15.48 | LED1.A 38.43,9.13 v39.28,9.13
  Bottom 0.254: D1.C 39.74,8.32 v39.28,7.86 | IC6.7 v46.39,12.3 | IC4.2 56.05,14.97 v55.54,15.48 | IC2.1 v18.96,14.97 | IC2.10 v30.39,14.97 | IC6.1 v46.39,19.92
  other vias: 40.3,7.86 40.3,9.13 30.39,6.59 30.39,5.57 29.12,5.57 29.12,6.59 25.31,6.59 25.31,5.57 24.04,5.57 24.04,6.59 20.23,6.59 20.23,5.57 18.96,5.57 18.96,6.59
  pour Route15 (no thermals): 59,16 59,0 0,0 0,23 4,23 4,14.5 5,13.5 10.5,13.5 11.5,14.5 11.5,15.5 12.5,16.5 39.5,16.5 40.5,17.5 40.5,23 41.5,24 46,24 47,23 47,22 48,21 51.5,21 52.5,20 52.5,17 53.5,16
  pour Bottom (no thermals): 30.77,7.22 30.77,5.06 28.87,5.06 28.87,7.22
  pour Bottom (no thermals): 25.69,7.22 25.69,5.06 23.79,5.06 23.79,7.22
  pour Bottom (no thermals): 20.61,7.22 20.61,5.06 18.71,5.06 18.71,7.22
VREF_PTC_CH  (via drill 0.3)
  Top 0.254: C13.1 54.78,17.57 v54.78,18.02 | CON1.2 53.63,32.52 v53.63,32.5 | v53.51,23.61 CON2.2
  Bottom 0.254: IC4.6 v54.78,18.02 | C12.1 54.01,33.51 53.63,33.13 v53.63,32.5 | C11.1 53.89,24.88 53.51,24.5 v53.51,23.61
  pour Route15 (no thermals): 53,33.5 53,17.5 54,16.5 59,16.5 59,33.5

### Text on the board
Bottom: bottom
tTest: 5V OK | 12V system- & / charger / controller | Interlock | TERA TU Graz, / Oktober 2015 / Pöschl | 3V3 | TS2 | 5V | Lock | TS1 | Feedback | LEM 1 | Plug Lock | CAN | Charger Interface | DC/DC ON | 12V | GND
bTest: 12V system & / charter / controller / V3.0